# Altium schematic sheet Speaker Out.SchDoc
size B
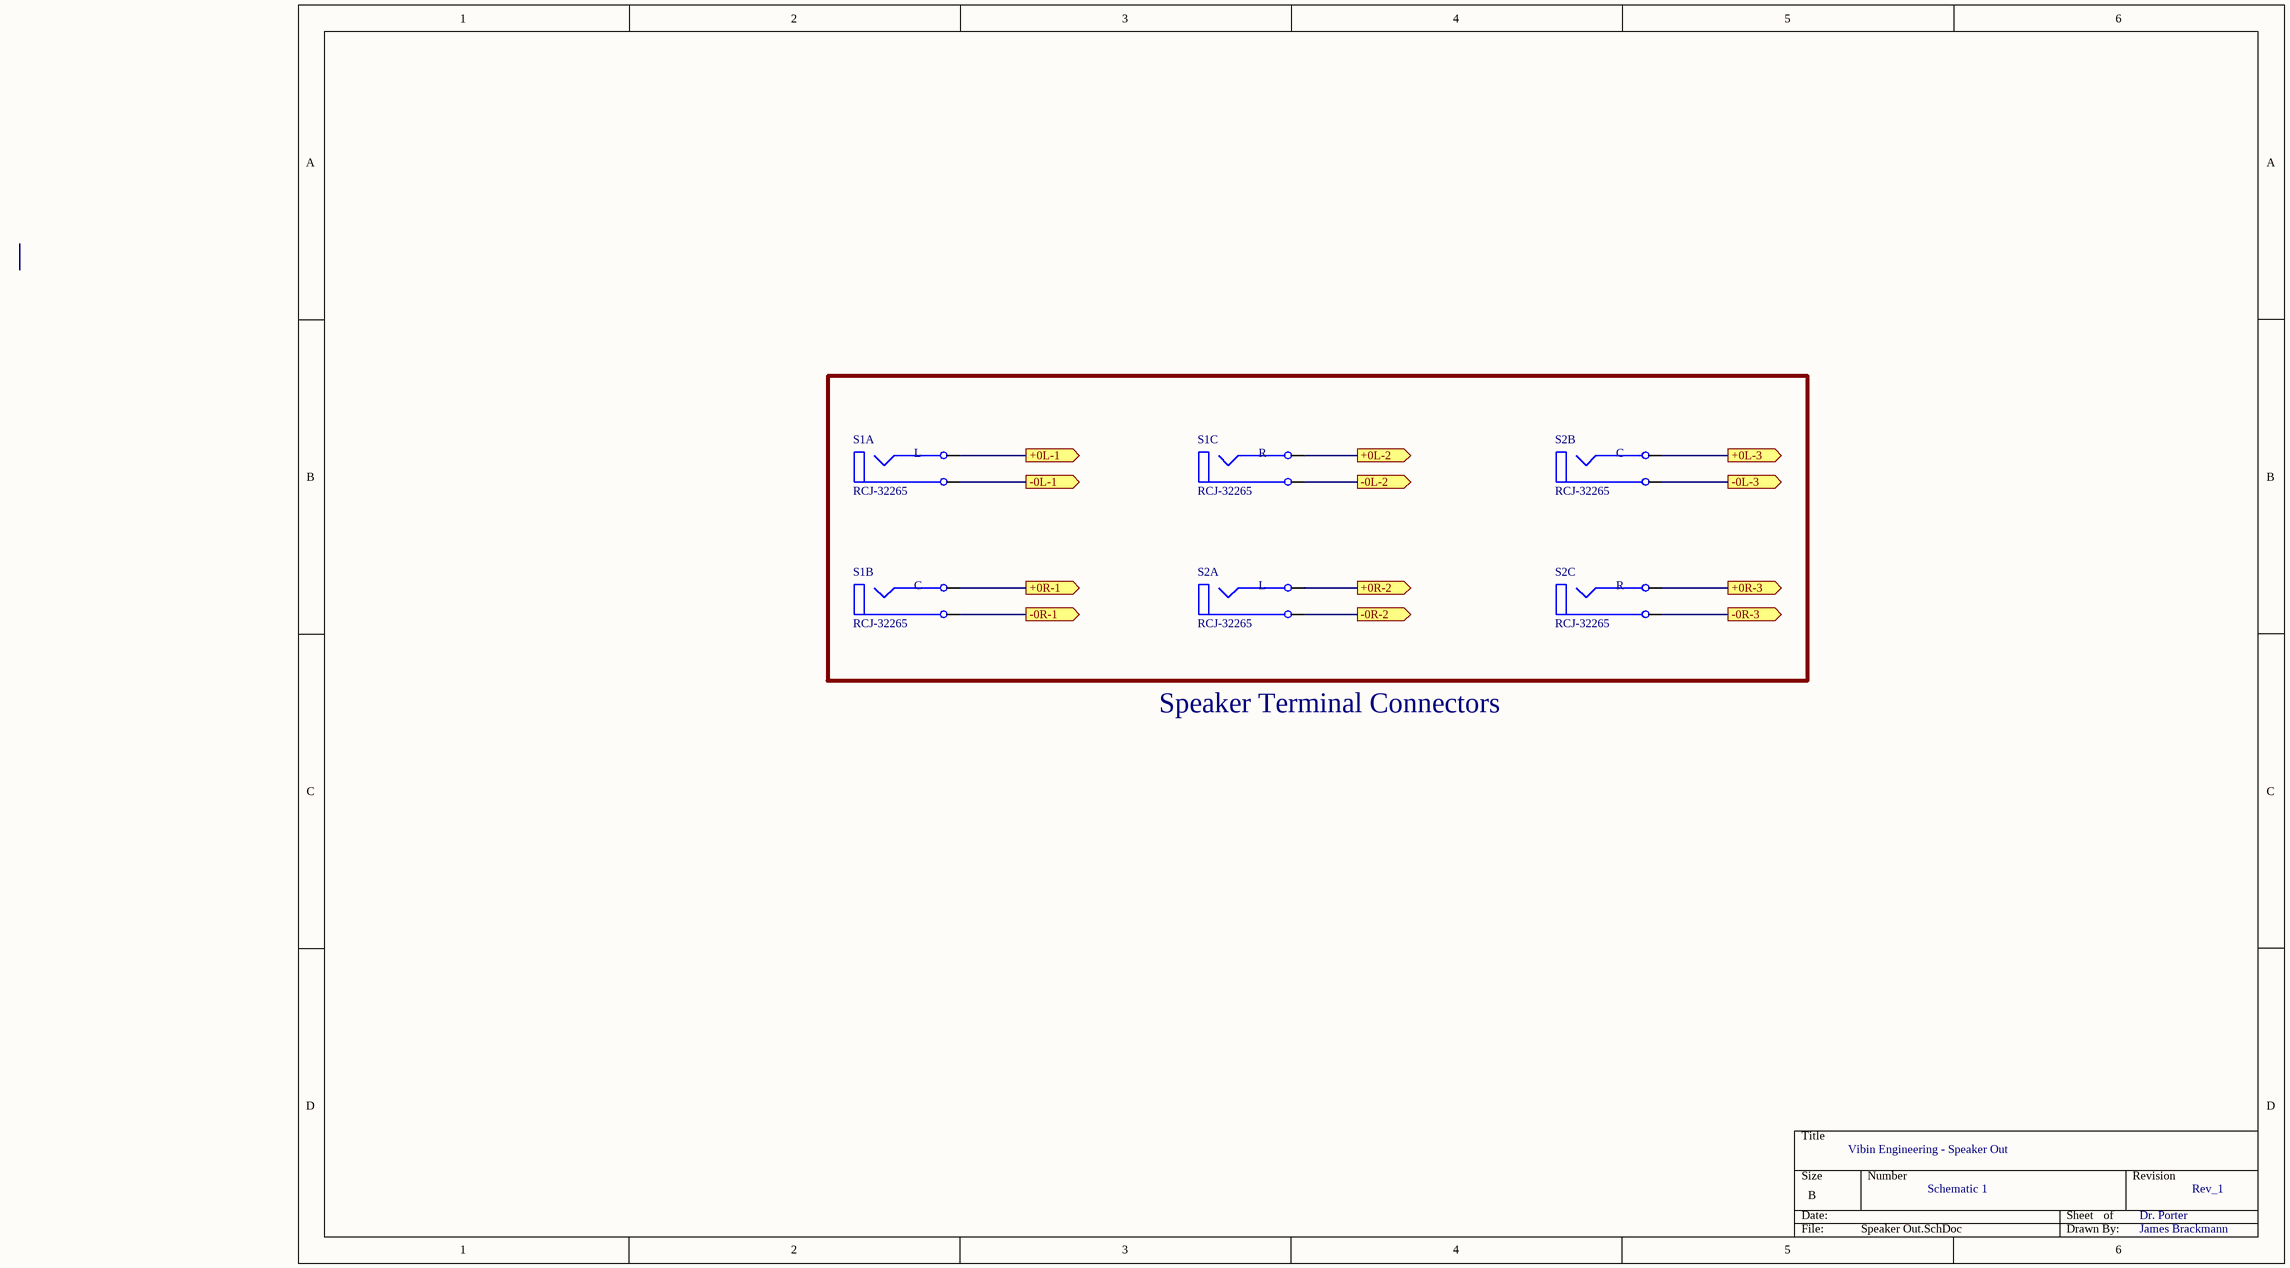
[diagram p0: Speaker Out.SchDoc]

## Parts
S1  RCJ-32265  [RCJ-32234]  (parts A,B,C of 3)
S2  RCJ-32265  [RCJ-32234]  (parts A,B,C of 3)

## Ports
+0L-1 (out), +0L-2 (out), +0L-3 (out), +0R-1 (out), +0R-2 (out), +0R-3 (out), -0L-1 (out), -0L-2 (out), -0L-3 (out), -0R-1 (out), -0R-2 (out), -0R-3 (out)

## Nets
+0L-1: S1.2 ; port +0L-1
+0L-2: S1.6 ; port +0L-2
+0L-3: S2.4 ; port +0L-3
+0R-1: S1.4 ; port +0R-1
+0R-2: S2.2 ; port +0R-2
+0R-3: S2.6 ; port +0R-3
-0L-1: S1.1 ; port -0L-1
-0L-2: S1.5 ; port -0L-2
-0L-3: S2.3 ; port -0L-3
-0R-1: S1.3 ; port -0R-1
-0R-2: S2.1 ; port -0R-2
-0R-3: S2.5 ; port -0R-3

## Notes on the sheet
- Speaker Terminal Connectors
- Vibin Engineering - Speaker Out
- Schematic 1
- Dr. Porter
- Rev_1
- James Brackmann
- (in symbol RCJ-32265, part A) L
- (in symbol RCJ-32265, part B) C
- (in symbol RCJ-32265, part C) R

## Library data of the parts
S1 S2 = RCJ-32265: 3 Port,  Right Angle, Through Hole, RCA Jack Connector; MF: CUI Devices; Package: None; Value: *; Availability: In Stock; SnapEDA_Link: https://www.snapeda.com/parts/RCJ-32265/CUI%20Devices/view-part/147683/?ref=snap; Price: None; MP: RCJ-32265; CUI_purchase_URL: https://www.cuidevices.com/product/interconnect/connectors/rca-connectors/rcj-32-series?utm_source=snapeda.com&utm_medium=referral&utm_campaign=snapedaBOM; Check_prices: https://www.snapeda.com/parts/RCJ-32265/CUI%20Devices/view-part/147683/?ref=eda